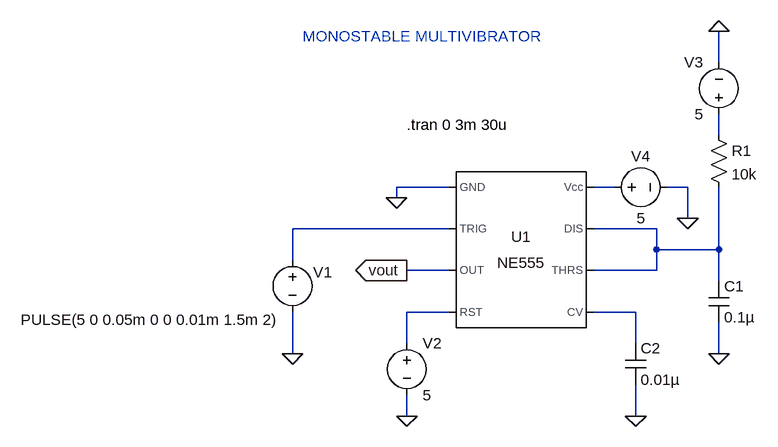
[diagram p0: schematic Monostable Multivibrator.asc]
Monostable Multivibrator.asc, the LTspice schematic file:
Version 4
SHEET 1 1008 680
WIRE 496 -112 496 -160
WIRE 496 0 496 -32
WIRE 80 80 0 80
WIRE 336 80 304 80
WIRE 448 80 416 80
WIRE 0 96 0 80
WIRE 448 128 448 80
WIRE 80 144 -160 144
WIRE 400 144 304 144
WIRE 400 176 400 144
WIRE 496 176 496 80
WIRE 496 176 400 176
WIRE -160 192 -160 144
WIRE 80 208 16 208
WIRE 400 208 400 176
WIRE 400 208 304 208
WIRE 496 224 496 176
WIRE 80 272 16 272
WIRE 368 272 304 272
WIRE 16 320 16 272
WIRE 368 320 368 272
WIRE -160 336 -160 272
WIRE 496 336 496 288
WIRE 16 432 16 400
WIRE 368 432 368 384
FLAG 496 336 0
FLAG 368 432 0
FLAG 0 96 0
FLAG -160 336 0
FLAG 448 128 0
FLAG 496 -160 0
FLAG 16 432 0
FLAG 16 208 vout
IOPIN 16 208 Out
SYMBOL Misc\\NE555 192 176 R0
SYMATTR InstName U1
SYMBOL cap 480 224 R0
SYMATTR InstName C1
SYMATTR Value 0.1µ
SYMBOL cap 352 320 R0
SYMATTR InstName C2
SYMATTR Value 0.01µ
SYMBOL res 480 -16 R0
SYMATTR InstName R1
SYMATTR Value 10k
SYMBOL voltage -160 176 R0
WINDOW 123 0 0 Left 2
WINDOW 39 0 0 Left 2
WINDOW 0 32 35 Left 2
WINDOW 3 -418 108 Left 2
SYMATTR InstName V1
SYMATTR Value PULSE(5 0 0.05m 0 0 0.01m 1.5m 2)
SYMBOL voltage 16 304 R0
WINDOW 123 0 0 Left 2
WINDOW 39 0 0 Left 2
SYMATTR InstName V2
SYMATTR Value 5
SYMBOL voltage 496 -16 R180
WINDOW 0 24 96 Left 2
WINDOW 3 24 16 Left 2
WINDOW 123 0 0 Left 2
WINDOW 39 0 0 Left 2
SYMATTR InstName V3
SYMATTR Value 5
SYMBOL voltage 320 80 R270
WINDOW 0 32 56 VTop 2
WINDOW 3 -32 56 VBottom 2
WINDOW 123 0 0 Left 2
WINDOW 39 0 0 Left 2
SYMATTR InstName V4
SYMATTR Value 5
TEXT 16 -16 Left 2 !.tran 0 3m 30u
TEXT -144 -152 Left 2 ;MONOSTABLE MULTIVIBRATOR

The netlist it stands for:
* Monostable Multivibrator.asc
XU1 0 N003 vout N005 N006 N004 N004 N002 NE555  ; pins GND TRIG OUT RST CV THRS DIS Vcc
C1 N004 0 0.1µ
C2 N006 0 0.01µ
R1 N001 N004 10k
V1 N003 0 PULSE(5 0 0.05m 0 0 0.01m 1.5m 2)
V2 N005 0 5
V3 N001 0 5
V4 N002 0 5
.tran 0 3m 30u
* MONOSTABLE MULTIVIBRATOR
.lib NE555.sub
.backanno
.end